# Altium schematic sheet LoopFilter.SchDoc
size A4; SheetNumber: 3; SheetTotal: 5
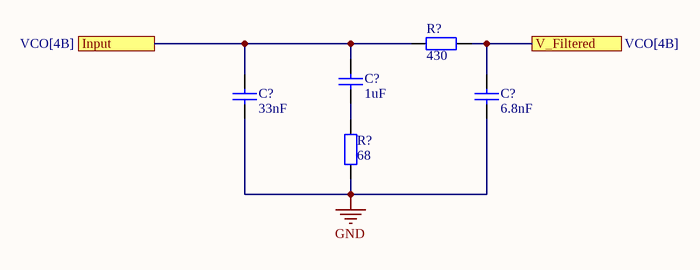
[diagram p0: LoopFilter.SchDoc]

## Parts
(Parts that share a designator on the sheet are numbered #1, #2 ... from top to bottom, then left to right.)
C?#1  1uF  [CAP_0402]
C?#2  33nF  [CAP_0402]
C?#3  6.8nF  [CAP_0402]
R?#1  430  [Res_0402]
R?#2  68  [Res_0402]

## Ports
Input (see VCO[4B]), V_Filtered (see VCO[4B])

## Nets
GND: C?#2.1 C?#3.1 R?#2.1
Input: C?#1.2 C?#2.2 R?#1.1 ; port Input
V_Filtered: C?#3.2 R?#1.2 ; port V_Filtered
NetC?#1_1: C?#1.1 R?#2.2

## Library data of the parts
C?#1-C?#3 = Capacitor: Manufacturer: Murata; Part Number: GRM155R71E103KA01D
R?#1 R?#2 = Resistor_EU